# EAGLE design board (EAGLE 6.5.0)
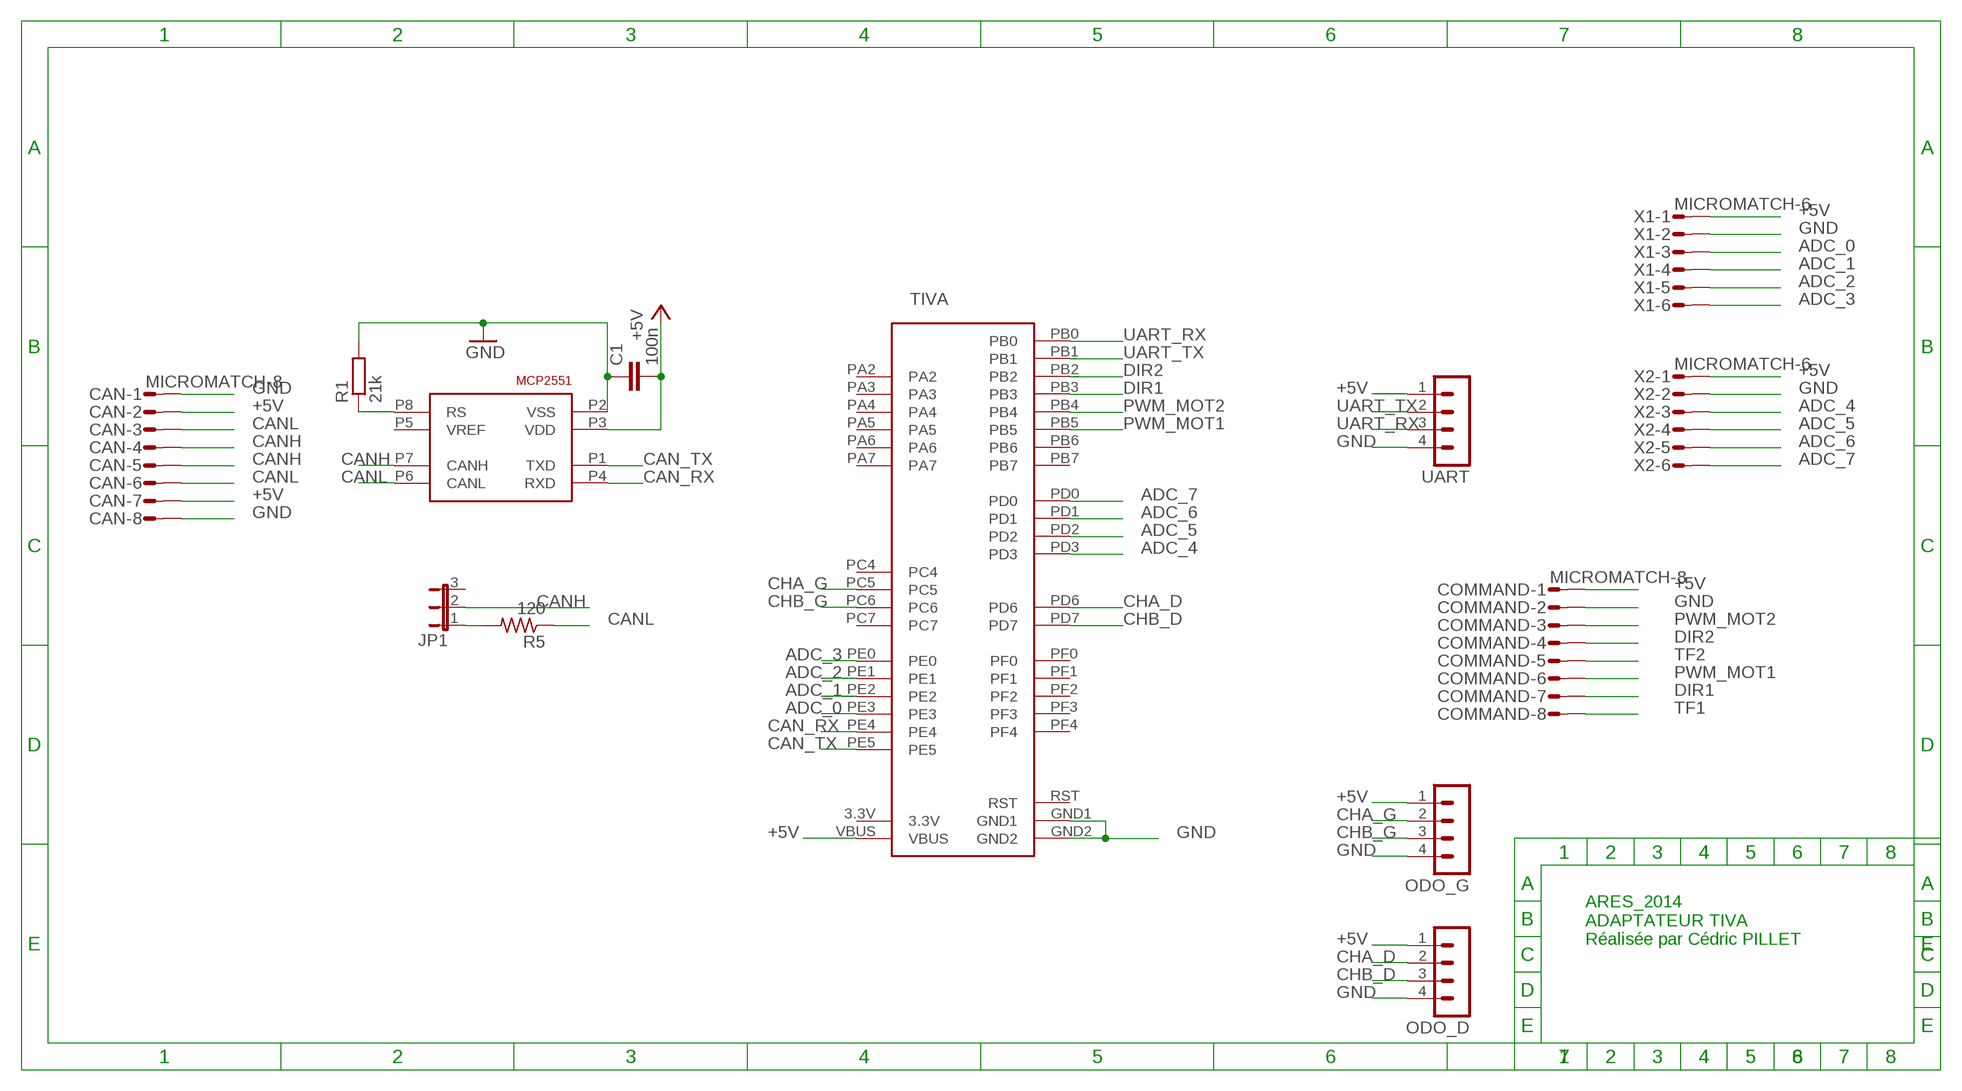
[diagram p0: schematic, sheet 1]

## Parts
C1  100n  C-EUC0805  [C0805]
CAN  MICROMATCH-8  [MICROMATCH-8]
COMMAND  MICROMATCH-8  [MICROMATCH-8]
JP1  JP2W  [JP2W]
ODO_D  MA04-1  [MA04-1]
ODO_G  MA04-1  [MA04-1]
R1  21k  R-EU_R0805  [R0805]
R5  120  R-US_M0805  [M0805]
TIVA  STELLARIS-LAUNCHPADSTELLARIS-LAUNCHPAD  [LAUNCHPAD-XL]
U$1  MCP2551  [SOIC_8]
UART  MA04-1  [MA04-1]
X1  MICROMATCH-6  [MICROMATCH-6]
X2  MICROMATCH-6  [MICROMATCH-6]

## Nets
+5V: C1.2 CAN.2 CAN.7 COMMAND.1 ODO_D.1 ODO_G.1 TIVA.VBUS U$1.P3(VDD) UART.1 X1.1 X2.1
ADC_0: TIVA.PE3 X1.3
ADC_1: TIVA.PE2 X1.4
ADC_2: TIVA.PE1 X1.5
ADC_3: TIVA.PE0 X1.6
ADC_4: TIVA.PD3 X2.3
ADC_5: TIVA.PD2 X2.4
ADC_6: TIVA.PD1 X2.5
ADC_7: TIVA.PD0 X2.6
CAN_RX: TIVA.PE4 U$1.P4(RXD)
CAN_TX: TIVA.PE5 U$1.P1(TXD)
CANH: CAN.4 CAN.5 JP1.2 U$1.P7(CANH)
CANL: CAN.3 CAN.6 R5.1 U$1.P6(CANL)
CHA_D: ODO_D.2 TIVA.PD6
CHA_G: ODO_G.2 TIVA.PC5
CHB_D: ODO_D.3 TIVA.PD7
CHB_G: ODO_G.3 TIVA.PC6
DIR1: COMMAND.7 TIVA.PB3
DIR2: COMMAND.4 TIVA.PB2
GND: C1.1 CAN.1 CAN.8 COMMAND.2 ODO_D.4 ODO_G.4 R1.2 TIVA.GND1 TIVA.GND2 U$1.P2(VSS) UART.4 X1.2 X2.2
N$1: R1.1 U$1.P8(RS)
N$9: JP1.1 R5.2
PWM_MOT1: COMMAND.6 TIVA.PB5
PWM_MOT2: COMMAND.3 TIVA.PB4
TF1: COMMAND.8
TF2: COMMAND.5
UART_RX: TIVA.PB0 UART.3
UART_TX: TIVA.PB1 UART.2
Unconnected: JP1.3 TIVA.PA2 TIVA.PA3 TIVA.PA4 TIVA.PA5 TIVA.PA6 TIVA.PA7 TIVA.PB6 TIVA.PB7 TIVA.PC4 TIVA.PC7 TIVA.PF0 TIVA.PF1 TIVA.PF2 TIVA.PF3 TIVA.PF4 U$1.P5(VREF)

## Notes on the sheet
- ARES_2014
  ADAPTATEUR TIVA
  Réalisée par Cédric PILLET

## Power pins joined to a net without a drawn wire
3.3V: TIVA.3.3V
RST: TIVA.RST

## Library data of the parts
C1 = rcl:C-EU: CAPACITOR, European symbol
CAN COMMAND = con-amp-micromatch:MICROMATCH-8: MicroMaTch 8 7-215464-8 / 0-215464-8 Drawing Number C-215464 DDEController.pdf; MF: FARNELL; MPN: 7-215464-8; OC_FARNELL: 3784642; OC_NEWARK: 26H0301
JP1 = jumper:JP2W: JUMPER
ODO_D ODO_G UART = con-lstb:MA04-1: PIN HEADER; OC_FARNELL: unknown; OC_NEWARK: unknown
R1 = rcl:R-EU_: RESISTOR, European symbol
R5 = rcl:R-US_: RESISTOR, American symbol
TIVA = fabhack:STELLARIS-LAUNCHPAD: Stellaris Launchpad LM4F120 using all header pins to connect to XL booster packs.
U$1 = microchip:MCP2551
X1 X2 = con-amp-micromatch:MICROMATCH-6: MicroMaTch 6 7-215464-6 / 0-215464-6 Drawing Number C-215464 DDEController.pdf; MPN: 7-215464-6; OC_FARNELL: 3784630; OC_NEWARK: 19R8125

## Board
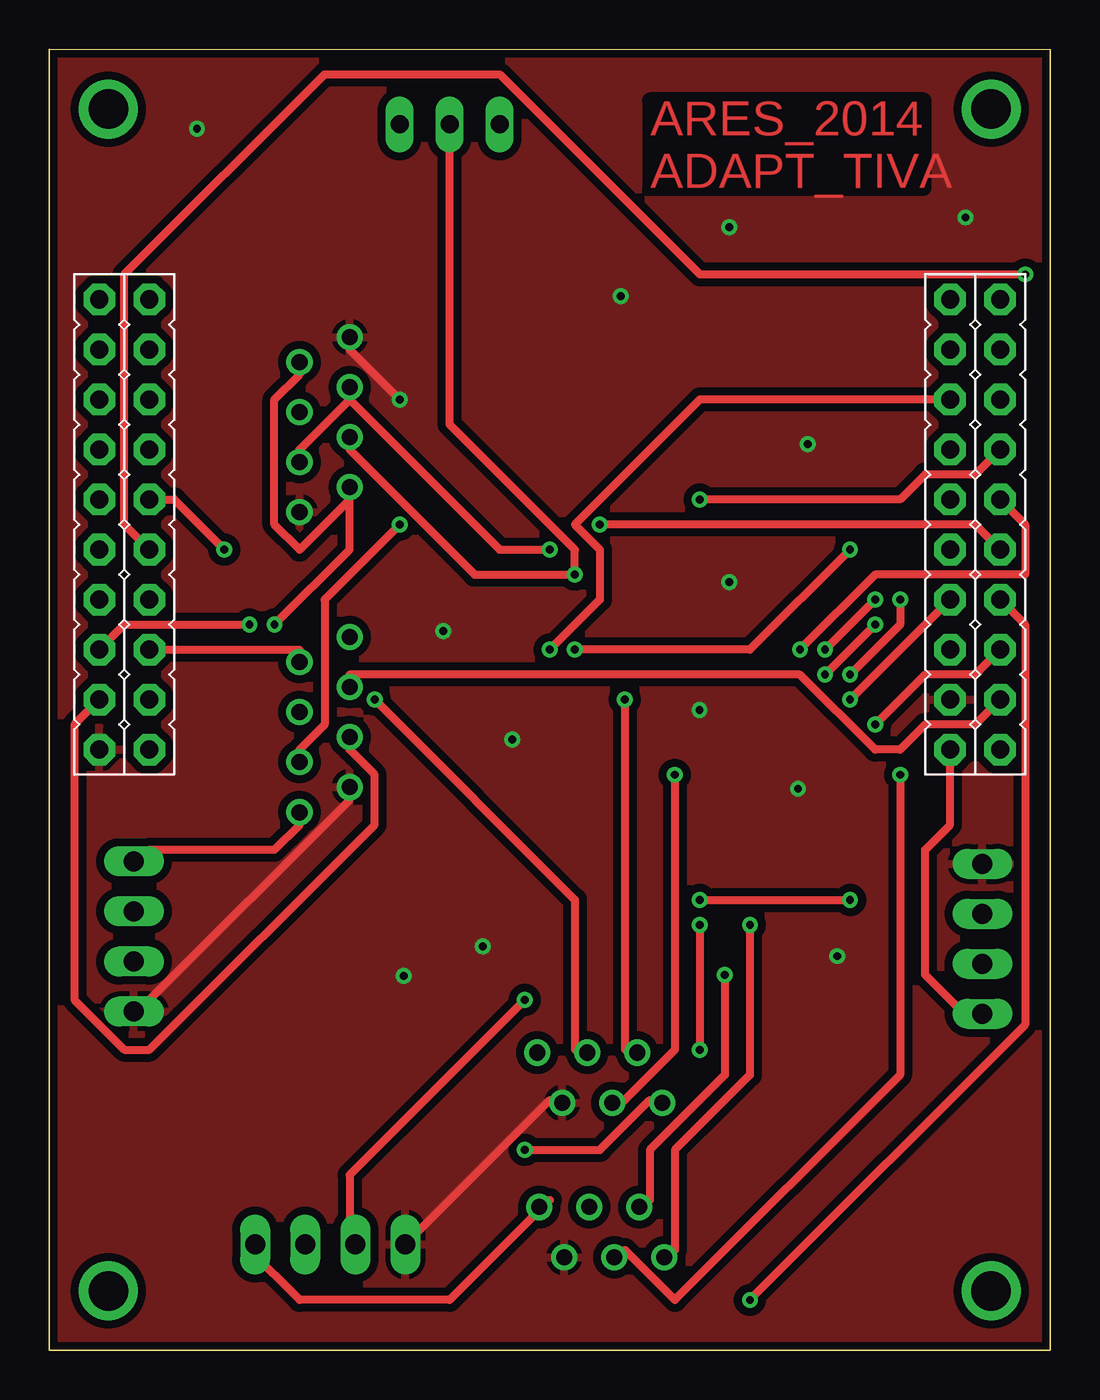
[diagram p1: board, top side]
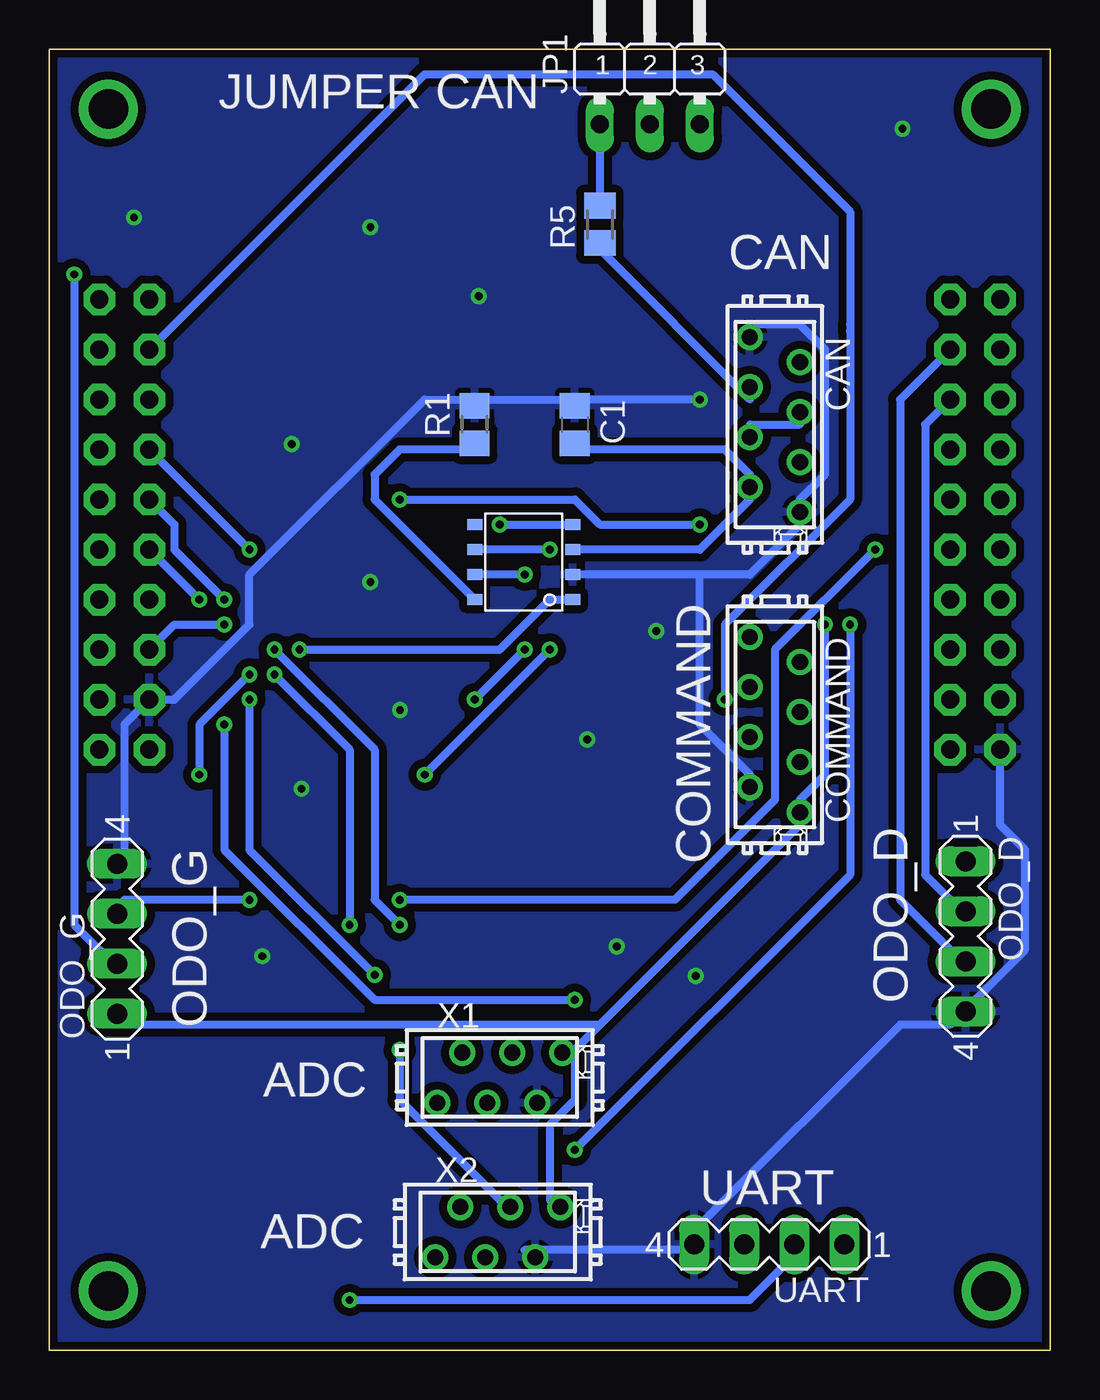
[diagram p2: board, bottom side, seen from below]

Size 50.8 x 66.05 mm. Coordinates in mm from the lower left corner, seen from the top.
Outline: 0,0.01 50.8,0 50.8,66.03 0,66.04 0,0.01
Copper layers (1*16): Top 0.035mm / dielectric 1.5mm / Bottom 0.035mm
Design rules "default *": minimum track width 0.4mm, minimum drill 0.4mm, track to track 0.2mm, track to pad 0.2mm, pad to pad 0.2mm, via to via 0.2mm, smd to smd 8mil, copper to edge 0.4mm, drill to drill 8mil, minimum pad ring 10mil, minimum via ring 8mil, stop-mask expansion 4mil, vias tented up to drill 0mil, thermal gap 10mil

### Footprints (pad centres in the part's own frame; a part is rotated, then mirrored left to right if it is on the bottom)
C0805 = smd 1.3 x 1.5: 1 -0.95,0; 2 0.95,0
MICROMATCH-8 = drill 0.813: 1 4.445,1.27; 2 3.175,-1.27; 3 1.905,1.27; 4 0.635,-1.27; 5 -0.635,1.27; 6 -1.905,-1.27; 7 -3.175,1.27; 8 -4.445,-1.27
JP2W = drill 0.914 long: 1 -2.54,-1.27; 2 0,-1.27; 3 2.54,-1.27
MA04-1 = drill 1.016 long: 1 -3.81,0; 2 -1.27,0; 3 1.27,0; 4 3.81,0
R0805 = smd 1.3 x 1.5: 1 -0.95,0; 2 0.95,0
M0805 = smd 1.3 x 1.6: 1 -0.95,0; 2 0.95,0
LAUNCHPAD-XL = drill 0.914 pad 1.6 octagon: 3.3V 30.48,2.54; GND1 33.02,5.08; GND2 30.48,48.26; PA2 53.34,48.26; PA3 50.8,48.26; PA4 48.26,48.26; PA5 48.26,2.54; PA6 50.8,2.54; PA7 53.34,2.54; PB0 35.56,2.54; PB1 38.1,2.54; PB2 33.02,48.26; PB3 35.56,45.72; PB4 45.72,2.54; PB5 33.02,2.54; PB6 45.72,48.26; PB7 43.18,48.26; PC4 38.1,45.72; PC5 40.64,45.72; PC6 43.18,45.72; PC7 45.72,45.72; PD0 35.56,5.08; PD1 38.1,5.08; PD2 40.64,5.08; PD3 43.18,5.08; PD6 48.26,45.72; PD7 50.8,45.72; PE0 35.56,48.26; PE1 45.72,5.08; PE2 48.26,5.08; PE3 50.8,5.08; PE4 40.64,2.54; PE5 43.18,2.54; PF0 38.1,48.26; PF1 53.34,5.08; PF2 30.48,45.72; PF3 33.02,45.72; PF4 53.34,45.72; RST 40.64,48.26; VBUS 30.48,5.08
SOIC_8 = smd 0.559 x 0.762: P1 0,-4.966; P2 1.27,-4.966; P3 2.54,-4.966; P4 3.81,-4.966; P5 3.81,0; P6 2.54,0; P7 1.27,0; P8 0,0
MICROMATCH-6 = drill 0.813: 1 3.175,1.27; 2 1.905,-1.27; 3 0.635,1.27; 4 -0.635,-1.27; 5 -1.905,1.27; 6 -3.175,-1.27

### Placement (x,y rotation side)
C1  24.13,47 270 bottom
CAN  13.97,47 270 bottom
COMMAND  13.97,31.76 270 bottom
JP1  20.32,63.51 0 bottom
ODO_D  4.3,21.01 270 bottom
ODO_G  47.36,20.89 90 bottom
R1  29.21,47 90 bottom
R5  22.86,57.16 90 bottom
TIVA  50.8,0.01 90 top
U$1  29.21,38.11 90 bottom
UART  14.26,5.37 180 bottom
X1  27.94,13.84 0 bottom
X2  28.04,6 0 bottom

### Tracks (layer width: path | path; a pad name or v marks a point on that pad's centre or on a via)
+5V  (via drill 0.4)
  Top 0.4: 15.24,43.19 12.7,40.65 11.43,41.92 11.43,48.27 12.7,49.54 CAN.7 | UART.1 10.16,5.09 12.7,2.55 20.32,2.55 25.4,7.63 X2.1 | ODO_D.1 5.08,25.41 11.43,25.41 12.7,26.68 COMMAND.1 | TIVA.VBUS 45.72,26.68 44.45,25.41 44.45,19.06 46.99,16.52 ODO_G.1 | 15.24,43.19 15.24,40.65 v11.43,36.84 | 15.24,43.19 CAN.2
  Bottom 0.4: U$1.P3 17.78,40.65 15.24,43.19 CAN.2 15.24,44.46 16.51,45.73 24.13,45.73 C1.2 | 22.86,16.52 12.7,26.68 COMMAND.1 12.7,27.95 11.43,29.22 v11.43,36.84 | 22.86,16.52 24.13,15.25 | 24.13,15.25 24.13,12.71 25.4,11.44 25.4,7.63 X2.1 | 24.13,15.25 X1.1 | 22.86,16.52 46.99,16.52 ODO_G.1
ADC_0  (via drill 0.4)
  Top 0.4: v16.51,33.03 26.67,22.87 26.67,15.25 X1.3
  Bottom 0.4: v16.51,33.03 16.51,36.84 10.16,43.19 10.16,51.73 10.16,52.08 | 20.32,64.78 31.75,64.78 TIVA.PE3
  Bottom 0.406: 20.32,64.78 17.13,64.78 10.15,57.8 10.15,51.74 10.16,51.73
ADC_1  (via drill 0.4)
  Top 0.4: v31.75,29.22 31.75,15.25 29.21,12.71 X1.4 | v25.4,35.57 27.94,38.11 27.94,40.65 26.67,41.92 33.02,48.27 TIVA.PE2
  Bottom 0.4: v25.4,35.57 v31.75,29.22
ADC_2  (via drill 0.4)
  Top 0.4: v29.21,33.03 29.21,15.25 X1.5 | v26.67,35.57 35.56,35.57 v40.64,40.65
  Bottom 0.4: v26.67,35.57 v29.21,33.03 | TIVA.PE1 v40.64,40.65
ADC_3  (via drill 0.4)
  Top 0.4: v24.13,10.17 27.94,10.17 30.48,12.71 X1.6 | v10.16,36.84 3.81,36.84 TIVA.PE0
  Bottom 0.4: v24.13,10.17 10.16,24.14 v10.16,36.84
ADC_4  (via drill 0.4)
  Top 0.4: v33.02,21.6 v33.02,15.25 | v41.91,38.11 v39.37,35.57
  Bottom 0.4: v33.02,15.25 33.02,12.71 27.94,7.63 X2.3 | v33.02,21.6 34.29,22.87 34.29,30.49 v39.37,35.57 | v41.91,38.11 44.45,40.65 44.45,41.92 TIVA.PD3
ADC_5  (via drill 0.4)
  Top 0.4: v43.18,29.22 43.18,13.98 31.75,2.55 29.21,5.09 X2.4 | v40.64,34.3 43.18,36.84 v43.18,38.11
  Bottom 0.4: v43.18,29.22 43.18,31.76 v40.64,34.3 | TIVA.PD2 v43.18,38.11
ADC_6  (via drill 0.4)
  Top 0.4: v34.29,19.06 34.29,13.98 30.48,10.17 30.48,7.63 X2.5 | TIVA.PD1 v40.64,33.03
  Bottom 0.4: v34.29,19.06 40.64,25.41 v40.64,33.03
ADC_7  (via drill 0.4)
  Top 0.4: v35.56,21.6 35.56,13.98 31.75,10.17 31.75,5.09 X2.6 | v41.91,36.84 v39.37,34.3
  Bottom 0.4: v35.56,21.6 35.56,30.49 v39.37,34.3 | v41.91,36.84 44.45,36.84 TIVA.PD0
CAN_RX  (via drill 0.4)
  Top 0.4: v27.94,41.92 46.99,41.92 TIVA.PE4
  Bottom 0.4: v27.94,41.92 U$1.P4 24.13,41.92
CAN_TX  (via drill 0.4)
  Top 0.4: v38.1,35.57 41.91,39.38 49.53,39.38 49.53,41.92 TIVA.PE5
  Bottom 0.4: v38.1,35.57 27.94,35.57 25.4,38.11 U$1.P1 24.13,38.11
CANH  (via drill 0.4)
  Top 0.4: CAN.4 15.24,45.73 21.59,39.38 v26.67,39.38 26.67,40.65 20.32,47 JP1.2
  Bottom 0.4: v26.67,39.38 U$1.P7 | CAN.5 12.7,47 15.24,47 CAN.4
CANL  (via drill 0.4)
  Top 0.4: v25.4,40.65 22.86,40.65 15.24,48.27 | 15.24,48.27 12.7,45.73 CAN.3 | 15.24,48.27 CAN.6
  Bottom 0.4: v25.4,40.65 U$1.P6 | R5.1 22.86,55.89 15.24,48.27 CAN.6
CHA_D
  Bottom 0.4: TIVA.PD6 6.35,47 6.35,24.14 5.08,22.87 ODO_D.2
CHA_G  (via drill 0.4)
  Top 0.4: v49.53,54.62 33.02,54.62 22.86,64.78 13.97,64.78 3.81,54.62 3.81,41.92 TIVA.PC5
  Bottom 0.4: v49.53,54.62 49.53,21.6 48.26,20.33 ODO_G.2
CHB_D
  Bottom 0.4: TIVA.PD7 7.62,48.27 7.62,22.87 5.08,20.33 ODO_D.3
CHB_G  (via drill 0.4)
  Top 0.4: v33.02,22.87 v40.64,22.87 | v8.89,40.65 6.35,43.19 TIVA.PC6
  Bottom 0.4: v40.64,22.87 46.99,22.87 ODO_G.3 | v33.02,22.87 19.05,22.87 13.97,27.95 13.97,35.57 v8.89,40.65
DIR1
  Top 0.4: TIVA.PB3 12.7,35.57 COMMAND.7
DIR2
  Top 0.4: TIVA.PB2 1.27,31.76 1.27,17.79 3.81,15.25 5.08,15.25 16.51,26.68 16.51,29.22 15.24,30.49 COMMAND.4
GND  (via drill 0.4)
  Top 0.4: X1.2 25.4,12.71 17.78,5.09 UART.4 | COMMAND.2 15.24,27.95 5.08,17.79 ODO_D.4 | v17.78,48.27 15.24,50.81 CAN.8
  Bottom 0.4: 29.21,48.27 24.13,48.27 | ODO_G.4 46.99,25.41 46.99,31.76 TIVA.GND1 44.45,33.03 40.64,36.84 40.64,39.38 31.75,48.27 29.21,48.27 | 29.21,48.27 R1.2 | 17.78,39.38 15.24,39.38 12.7,41.92 CAN.1 12.7,43.19 11.43,44.46 11.43,50.81 12.7,52.08 15.24,52.08 CAN.8 | 17.78,39.38 U$1.P2 | X2.2 26.67,5.09 17.78,5.09 UART.4 17.78,6.36 7.62,16.52 5.08,16.52 ODO_D.4 3.81,17.79 1.27,20.33 1.27,25.41 2.54,26.68 TIVA.GND2 | 17.78,39.38 17.78,31.76 15.24,29.22 COMMAND.2 | v17.78,48.27 24.13,48.27 | 24.13,48.27 C1.1
  other vias: 29,53.51 46.5,57.51 23.5,31.01 34.5,57.01 7.5,62.01 38.5,46.01 34.5,39.01 20,36.51 33,32.51 38,28.51 40,20.01 22,20.51 18,19.01
  pour Top (isolate 0.406): 0,66.01 51,66.01 51,0.01 0,0.01
  pour Bottom (isolate 0.406): 0,66.01 51,66.01 51,0.01 0,0.01
N$1
  Bottom 0.4: U$1.P8 34.29,43.19 34.29,44.46 33.02,45.73 29.21,45.73 R1.1
N$2  (via drill 2)
  other vias: 3,63.01
N$3  (via drill 2)
  other vias: 47.8,63.01
N$4  (via drill 2)
  other vias: 47.8,3.01
N$5  (via drill 2)
  other vias: 3,3.01
N$9
  Bottom 0.4: JP1.1 R5.2
PWM_MOT1
  Top 0.4: TIVA.PB5 46.99,31.76 44.45,31.76 43.18,30.49 41.91,30.49 38.1,34.3 15.24,34.3 COMMAND.6
PWM_MOT2  (via drill 0.4)
  Top 0.4: v17.78,41.92 13.97,38.11 13.97,31.76 12.7,30.49 COMMAND.3 | v33.02,43.19 43.18,43.19 44.45,44.46 46.99,44.46 TIVA.PB4
  Bottom 0.4: v17.78,41.92 22.86,41.92 24.13,43.19 v33.02,43.19
UART_RX  (via drill 0.4)
  Top 0.4: v24.13,17.79 15.24,8.9 15.24,6.36 UART.3 | v41.91,31.76 44.45,34.3 46.99,34.3 TIVA.PB0
  Bottom 0.4: v24.13,17.79 34.29,17.79 41.91,25.41 v41.91,31.76
UART_TX  (via drill 0.4)
  Top 0.4: v35.56,2.55 49.53,16.52 49.53,36.84 TIVA.PB1
  Bottom 0.4: v35.56,2.55 15.24,2.55 12.7,5.09 UART.2

### Text on the board
Top: ARES_2014 / ADAPT_TIVA
bPlace: JUMPER CAN | CAN | ODO_D | COMMAND | ODO_G | ADC | UART | ADC